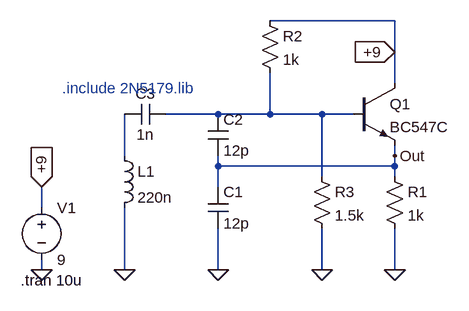
[diagram p0: schematic self-osc-example.asc]
self-osc-example.asc, the LTspice schematic file:
Version 4
SHEET 1 880 680
WIRE 416 -16 224 -16
WIRE 416 32 416 -16
WIRE 416 80 416 32
WIRE 144 128 64 128
WIRE 224 128 224 64
WIRE 224 128 144 128
WIRE 304 128 224 128
WIRE 352 128 304 128
WIRE 0 192 0 128
WIRE 416 192 416 176
WIRE 144 208 144 192
WIRE 416 208 416 192
WIRE 416 208 144 208
WIRE 304 224 304 128
WIRE 416 224 416 208
WIRE 144 240 144 208
WIRE -128 272 -128 240
WIRE -128 368 -128 352
WIRE 0 368 0 272
WIRE 144 368 144 304
WIRE 304 368 304 304
WIRE 416 368 416 304
FLAG -128 368 0
FLAG -128 240 +9
IOPIN -128 240 In
FLAG 416 368 0
FLAG 304 368 0
FLAG 144 368 0
FLAG 0 368 0
FLAG 416 192 Out
FLAG 416 32 +9
IOPIN 416 32 In
SYMBOL ind -16 176 R0
SYMATTR InstName L1
SYMATTR Value 220n
SYMBOL cap 128 240 R0
SYMATTR InstName C1
SYMATTR Value 12p
SYMBOL cap 128 128 R0
SYMATTR InstName C2
SYMATTR Value 12p
SYMBOL cap 64 112 R90
WINDOW 0 0 32 VBottom 2
WINDOW 3 32 32 VTop 2
SYMATTR InstName C3
SYMATTR Value 1n
SYMBOL res 400 208 R0
SYMATTR InstName R1
SYMATTR Value 1k
SYMBOL res 208 -32 R0
SYMATTR InstName R2
SYMATTR Value 1k
SYMBOL res 288 208 R0
SYMATTR InstName R3
SYMATTR Value 1.5k
SYMBOL npn 352 80 R0
SYMATTR InstName Q1
SYMATTR Value BC547C
SYMBOL voltage -128 256 R0
WINDOW 123 0 0 Left 0
WINDOW 39 0 0 Left 0
SYMATTR InstName V1
SYMATTR Value 9
TEXT -160 384 Left 2 !.tran 10u
TEXT -96 88 Left 2 ;.include 2N5179.lib

The netlist it stands for:
* self-osc-example.asc
L1 N002 0 220n
C1 Out 0 12p
C2 N001 Out 12p
C3 N001 N002 1n
R1 Out 0 1k
R2 +9 N001 1k
R3 N001 0 1.5k
Q1 +9 N001 Out 0 BC547C
V1 +9 0 9
.model NPN NPN
.model PNP PNP
.lib standard.bjt
.tran 10u
* .include 2N5179.lib
.backanno
.end